# EAGLE design zeroG4 (EAGLE 5.11)
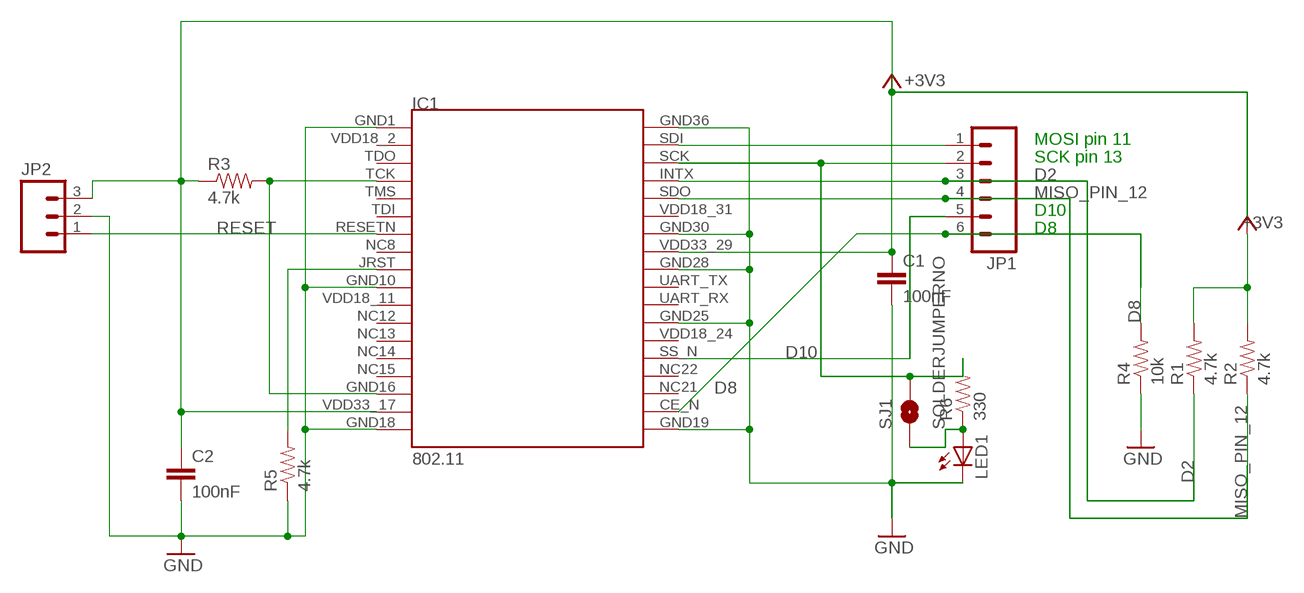
[diagram p0: schematic, sheet 1]

## Parts
C1  100nF  CAPPTH1  [CAP-PTH-5MM]
C2  100nF  CAPPTH1  [CAP-PTH-5MM]
IC1  802.11  ZG2100MOD  [ZG2100MOD]
JP1  M06SIP  [1X06]
JP2  M03PTH  [1X03]
LED1  LED3MM  [LED3MM]
R1  4.7k  RESISTORPTH-1/6W  [1/6W-RES]
R2  4.7k  RESISTORPTH-1/6W  [1/6W-RES]
R3  4.7k  RESISTORPTH-1/6W  [1/6W-RES]
R4  10k  RESISTORPTH-1/6W  [1/6W-RES]
R5  4.7k  RESISTORPTH-1/6W  [1/6W-RES]
R6  330  RESISTORPTH-1/6W  [1/6W-RES]
SJ1  SOLDERJUMPERNO  [SJ_2S-NO]

## Nets
+3V3: C1.1 C2.1 IC1.VDD33_17 IC1.VDD33_29 JP2.3 R1.2 R2.2 R3.1
D2: IC1.INTX JP1.3 R1.1
D8: IC1.CE_N JP1.6 R4.2
D10: IC1.SS_N JP1.5
GND [vcc]: C1.2 C2.2 IC1.GND1 IC1.GND10 IC1.GND18 IC1.GND19 IC1.GND25 IC1.GND28 IC1.GND30 IC1.GND36 JP2.2 LED1.K(C) R4.1 R5.1
JRST: IC1.JRST R5.2
MISO_PIN_12: IC1.SDO JP1.4 R2.1
N$1: IC1.SCK JP1.2 R6.2 SJ1.2
N$2: IC1.SDI JP1.1
N$3: LED1.A R6.1 SJ1.1
RESET: IC1.RESETN(RSTN) JP2.1
VDD_TIE: IC1.GND16 IC1.TCK R3.2
Unconnected: IC1.NC8 IC1.NC12 IC1.NC13 IC1.NC14 IC1.NC15 IC1.NC21 IC1.NC22 IC1.TDI IC1.TDO IC1.TMS IC1.UART_RX IC1.UART_TX IC1.VDD18_2 IC1.VDD18_11 IC1.VDD18_24 IC1.VDD18_31

## Notes on the sheet
- MOSI pin 11
- SCK pin 13
- D10
- D8

## Library data of the parts
C1 C2 = SparkFun:CAP: Capacitor Standard 0603 ceramic capacitor, and 0.1" leaded capacitor.
IC1 = ZGLIB:ZG2100MOD: ZG2100 Module
JP1 = SparkFun:M06: Header 6 Standard 6-pin 0.1" header. Use with straight break away headers (SKU : PRT-00116), right angle break away headers (PRT-00553), swiss pins (PRT-00743), machine pins (PRT-00117), and female headers (PRT-00115). Molex polarized connector foot print use with SKU : PRT-08094 with associated crimp pins and housings. NOTES ON THE VARIANTS LOCK and LOCK_LONGPADS... This footprint was designed to help hold the alignment of a through-hole component (i.e. 6-pin header) while soldering it into place. You may notice that each hole has been shifted either up or down by 0.005 of an inch from it's more standard position (which is a perfectly straight line). This slight alteration caused the pins (the squares in the middle) to touch the edges of the holes. Because they are alternating, it causes a "brace" to hold the component in place. 0.005 has proven to be the perfect amount of "off-center" position when using our standard breakaway headers. Although looks a little odd when you look at the bare footprint, once you have a header in there, the alteration is very hard to notice. Also, if you push a header all the way into place, it is covered up entirely on the bottom side. This idea of altering the position of holes to aid alignment will be further integrated into the Sparkfun Library for other footprints. It can help hold any component with 3 or more connection pins.
JP2 = SparkFun:M03: Header 3 Standard 3-pin 0.1" header. Use with straight break away headers (SKU : PRT-00116), right angle break away headers (PRT-00553), swiss pins (PRT-00743), machine pins (PRT-00117), and female headers (PRT-00115). Molex polarized connector foot print use with SKU : PRT-08232 with associated crimp pins and housings.
LED1 = SparkFun:LED: LEDs Standard schematic elements and footprints for 5mm, 3mm, 1206, and 0603 sized LEDs. 5mm - Spark Fun Electronics SKU : COM-00529 (and others)
R1-R6 = SparkFun:RESISTOR: Resistor Basic schematic elements and footprints for 0603, 1206, and PTH resistors.
SJ1 = SparkFun:SOLDERJUMPER: Solder Jumper Standard SMD solder jumper. Used to automate production. Two varients : Normally Open and Normally Closed are the same, but have different paste layers. NC will have a large amount of paste and should jumper during reflow.

## Net classes
0 default: width 0.203 mm
1 vcc: width 0.254 mm

## Board
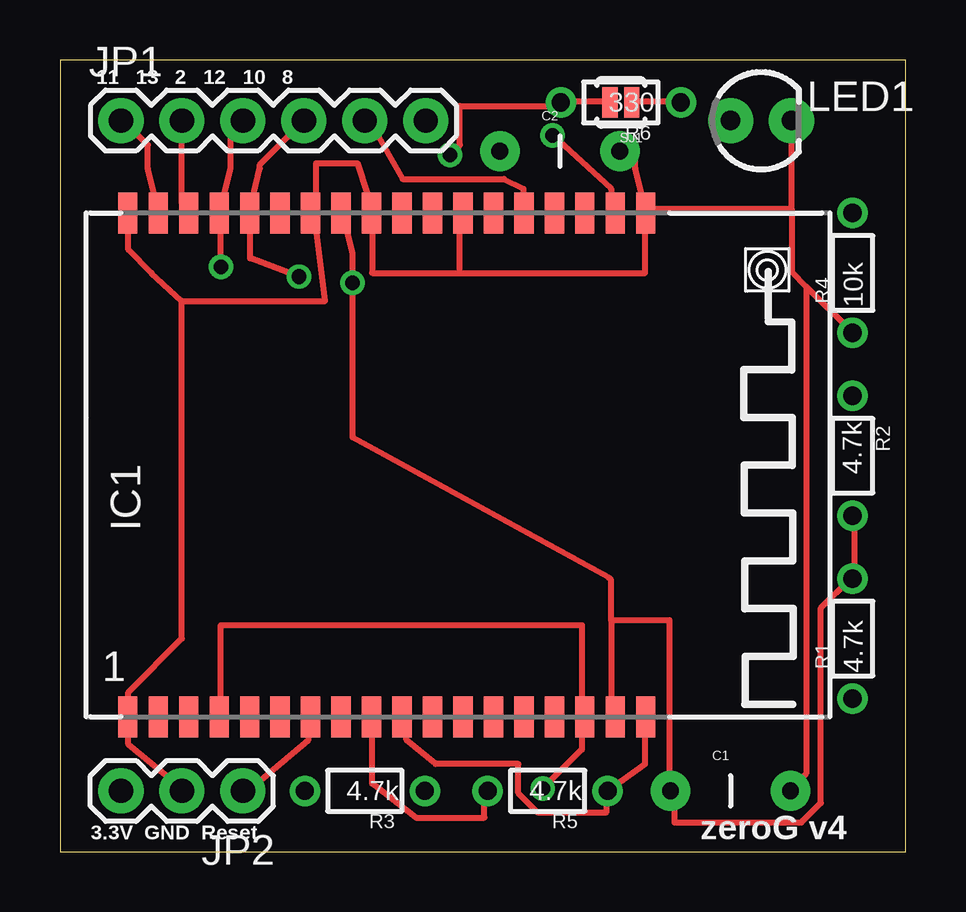
[diagram p1: board, top side]
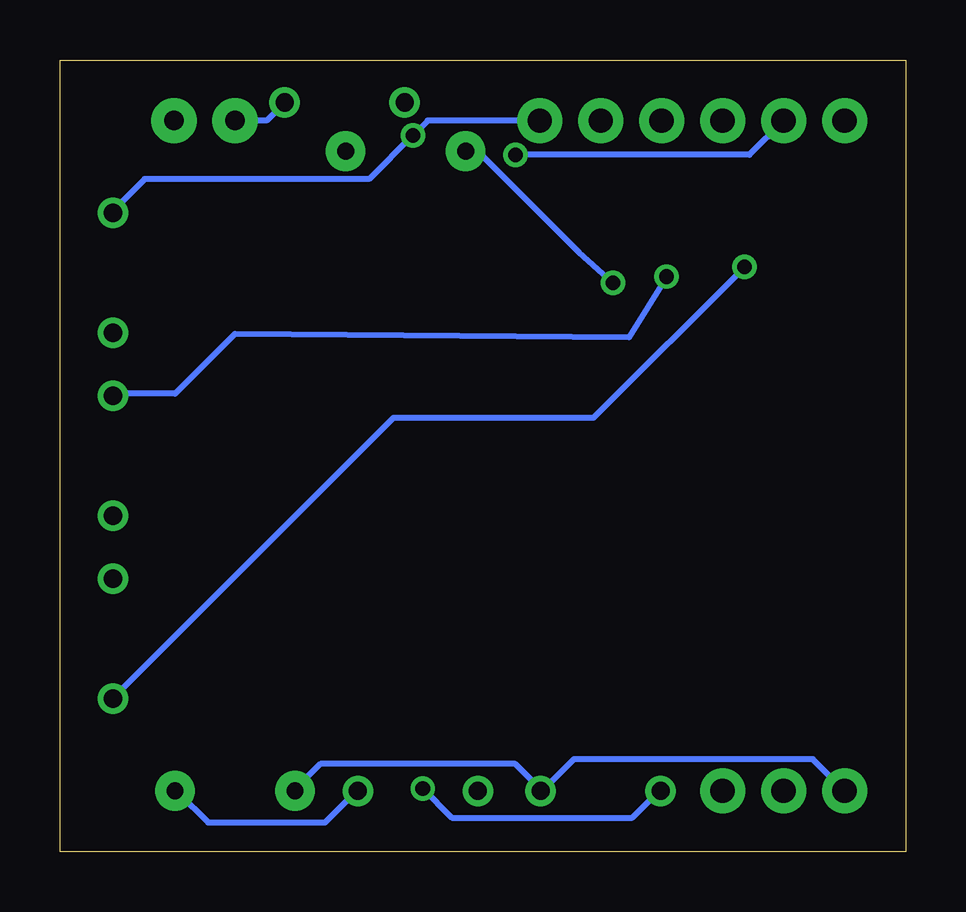
[diagram p2: board, bottom side, seen from below]

Size 35.23 x 33.01 mm. Coordinates in mm from the lower left corner, seen from the top.
Outline: 0,0 35.23,0 35.23,33.01 0,33.01 0,0
Copper layers (1*16): Top 0.035mm / dielectric 1.5mm / Bottom 0.035mm
Design rules "default": minimum track width 10mil, minimum drill 24mil, track to track 8mil, track to pad 8mil, pad to pad 8mil, via to via 8mil, smd to smd 8mil, copper to edge 40mil, drill to drill 8mil, minimum pad ring 10mil, minimum via ring 8mil, stop-mask expansion 4mil, vias tented up to drill 0mil, thermal gap 10mil

### Footprints (pad centres in the part's own frame; a part is rotated, then mirrored left to right if it is on the bottom)
CAP-PTH-5MM = drill 0.7 pad 1.651 round: 1 -2.5,0; 2 2.5,0
ZG2100MOD = smd 0.8 x 1.7: CE_N 6.63,10.12; GND1 -13.69,-10.88; GND10 -2.26,-10.88; GND16 5.36,-10.88; GND18 7.9,-10.88; GND19 7.9,10.12; GND25 0.28,10.12; GND28 -3.53,10.12; GND30 -6.07,10.12; GND36 -13.69,10.12; INTX -9.88,10.12; JRST -3.53,-10.88; NC8 -4.8,-10.88; NC12 0.28,-10.88; NC13 1.55,-10.88; NC14 2.82,-10.88; NC15 4.09,-10.88; NC21 5.36,10.12; NC22 4.09,10.12; RESETN -6.07,-10.88; SCK -11.15,10.12; SDI -12.42,10.12; SDO -8.61,10.12; SS_N 2.82,10.12; TCK -9.88,-10.88; TDI -7.34,-10.88; TDO -11.15,-10.88; TMS -8.61,-10.88; UART_RX -0.99,10.12; UART_TX -2.26,10.12; VDD18_2 -12.42,-10.88; VDD18_11 -0.99,-10.88; VDD18_24 1.55,10.12; VDD18_31 -7.34,10.12; VDD33_17 6.63,-10.88; VDD33_29 -4.8,10.12
1X06 = drill 1.016 pad 1.88 round: 1 0,0; 2 2.54,0; 3 5.08,0; 4 7.62,0; 5 10.16,0; 6 12.7,0
1X03 = drill 1.016 pad 1.88 round: 1 0,0; 2 2.54,0; 3 5.08,0
LED3MM = drill 0.813 pad 1.88 round: A -1.27,0; K 1.27,0
1/6W-RES = drill 0.762 round: 1 -2.5,0; 2 2.5,0
SJ_2S-NO = smd 0.635 x 1.27: 1 -0.45,0; 2 0.45,0

### Placement (x,y rotation side)
C1  27.94,2.54 0 top
C2  20.83,29.21 0 top
IC1  16.51,16.51 0 top
JP1  2.54,30.48 0 top
JP2  7.62,2.54 180 top
LED1  29.21,30.48 0 top
R1  33.02,8.89 90 top
R2  33.02,16.51 270 top
R3  12.7,2.54 180 top
R4  33.02,24.13 90 top
R5  20.32,2.54 180 top
R6  23.37,31.24 180 top
SJ1  23.37,31.24 180 top

### Tracks (layer width: path | path; a pad name or v marks a point on that pad's centre or on a via)
+3V3  (via drill 0.61)
  Top 0.254: 22.96,9.65 22.96,11.33 22.86,11.43 12.19,17.27 v12.19,23.72 12.19,24.94 11.79,26.62 IC1.VDD33_29 | IC1.VDD33_17 22.96,5.69 22.96,9.65 | R2.2 33.12,13.82 33.12,11.58 R1.2 32.92,11.38 31.7,10.16 31.7,2.03 30.89,1.22 25.6,1.22 25.6,2.44 C1.1 25.4,2.64 25.4,9.65 22.96,9.65
  Bottom 0.254: v12.19,23.72 13.61,24.99 17.68,29.06 C2.1 | C1.1 25.4,2.64 24.38,3.66 16.26,3.66 15.24,2.64 R3.1 15.04,2.64 13.82,3.86 3.86,3.86 JP2.3
D2  (via drill 0.61)
  Top 0.254: JP1.3 7.52,30.48 7.11,30.07 7.11,28.5 6.71,26.82 IC1.INTX 6.71,26.62 v6.71,24.38
  Bottom 0.254: v6.71,24.38 13.01,18.09 21.34,18.09 32.92,6.5 R1.1
D8  (via drill 0.61)
  Top 0.254: v20.52,29.87 22.96,27.64 22.96,26.82 IC1.CE_N
  Bottom 0.254: JP1.6 19.91,30.48 v20.52,29.87 22.35,28.04 31.7,28.04 32.92,26.82 R4.2
D10
  Top 0.254: IC1.SS_N 19.3,26.82 19.3,27.64 18.49,28.04 14.28,28.04 13.01,30.28 12.8,30.48 JP1.5
GND
  Top 0.254: JP2.2 5.08,2.64 2.85,4.47 2.85,5.49 IC1.GND1 2.85,5.69 2.85,6.66 5.08,8.89 5.08,22.96 | 5.08,22.96 3.81,24.13 2.85,25.09 2.85,26.62 IC1.GND36 | IC1.GND10 14.43,5.49 14.43,4.67 15.65,3.66 19.1,3.66 19.1,2.44 19.91,1.63 22.76,1.63 22.76,2.44 R5.1 22.96,2.64 24.38,3.66 24.38,5.49 IC1.GND18 | 31.09,23.57 30.48,24.18 30.48,26.82 | 31.09,23.57 32.92,21.74 R4.1 | 30.48,26.82 LED1.K | 10.67,25.96 10.57,26.82 IC1.GND30 | 10.67,25.96 10.67,28.7 12.39,28.7 12.8,27.43 12.8,26.82 IC1.GND28 13.01,26.62 13.01,24.13 16.66,24.13 | 16.66,24.13 16.66,26.62 IC1.GND25 | IC1.GND19 24.38,26.82 23.98,28.5 23.98,29.06 C2.2 | 16.66,24.13 24.38,24.13 24.38,26.62 IC1.GND19 | 30.48,26.82 24.59,26.82 IC1.GND19 | 31.09,23.57 31.09,3.25 30.48,2.64 C1.2 | 5.08,22.96 11.05,22.96 10.67,25.96
  Bottom 0.254: C1.2 30.28,2.44 29.06,1.22 24.18,1.22 22.96,2.44 R5.1
JRST
  Top 0.254: IC1.JRST 13.01,5.49 13.01,2.85 14.83,1.42 17.68,1.42 17.68,2.44 R5.2
MISO_PIN_12  (via drill 0.61)
  Top 0.254: JP1.4 8.33,28.65 8.33,28.5 7.92,26.82 IC1.SDO 7.92,26.62 7.92,24.74 v9.96,23.98
  Bottom 0.254: v9.96,23.98 11.53,21.44 27.94,21.59 30.43,19.1 32.92,19.1 R2.1
N$1  (via drill 0.61)
  Top 0.254: SJ1.2 22.76,31.29 20.93,31.29 R6.2 20.73,31.09 16.66,31.09 16.66,29.46 v16.26,29.06 | JP1.2 5.08,27.03 5.28,26.82 IC1.SCK
  Bottom 0.254: v16.26,29.06 6.5,29.06 JP1.2
N$2
  Top 0.254: IC1.SDI 4.06,26.82 3.66,28.5 3.66,29.46 2.64,30.48 JP1.1
N$3
  Top 0.254: SJ1.1 23.98,31.29 25.81,31.29 R6.1
  Bottom 0.254: R6.1 26.01,31.09 26.62,30.48 LED1.A
RESET
  Top 0.254: IC1.RESETN 10.36,5.49 10.36,4.67 7.72,2.44 JP2.1
VDD_TIE  (via drill 0.61)
  Top 0.254: IC1.TCK 6.71,5.69 6.71,9.45 21.74,9.45 21.74,5.69 IC1.GND16 21.74,5.49 21.74,4.27 v20.12,2.64
  Bottom 0.254: v20.12,2.64 18.9,1.42 11.38,1.42 10.36,2.44 R3.2

### Text on the board
tPlace: 11 13 2 12 10 8 | 3.3V GND Reset | zeroG v4